# Altium schematic sheet Peripherals.SchDoc: Peripherals
size A3; Author: Silard Gal; SheetNumber: 6; SheetTotal: 7
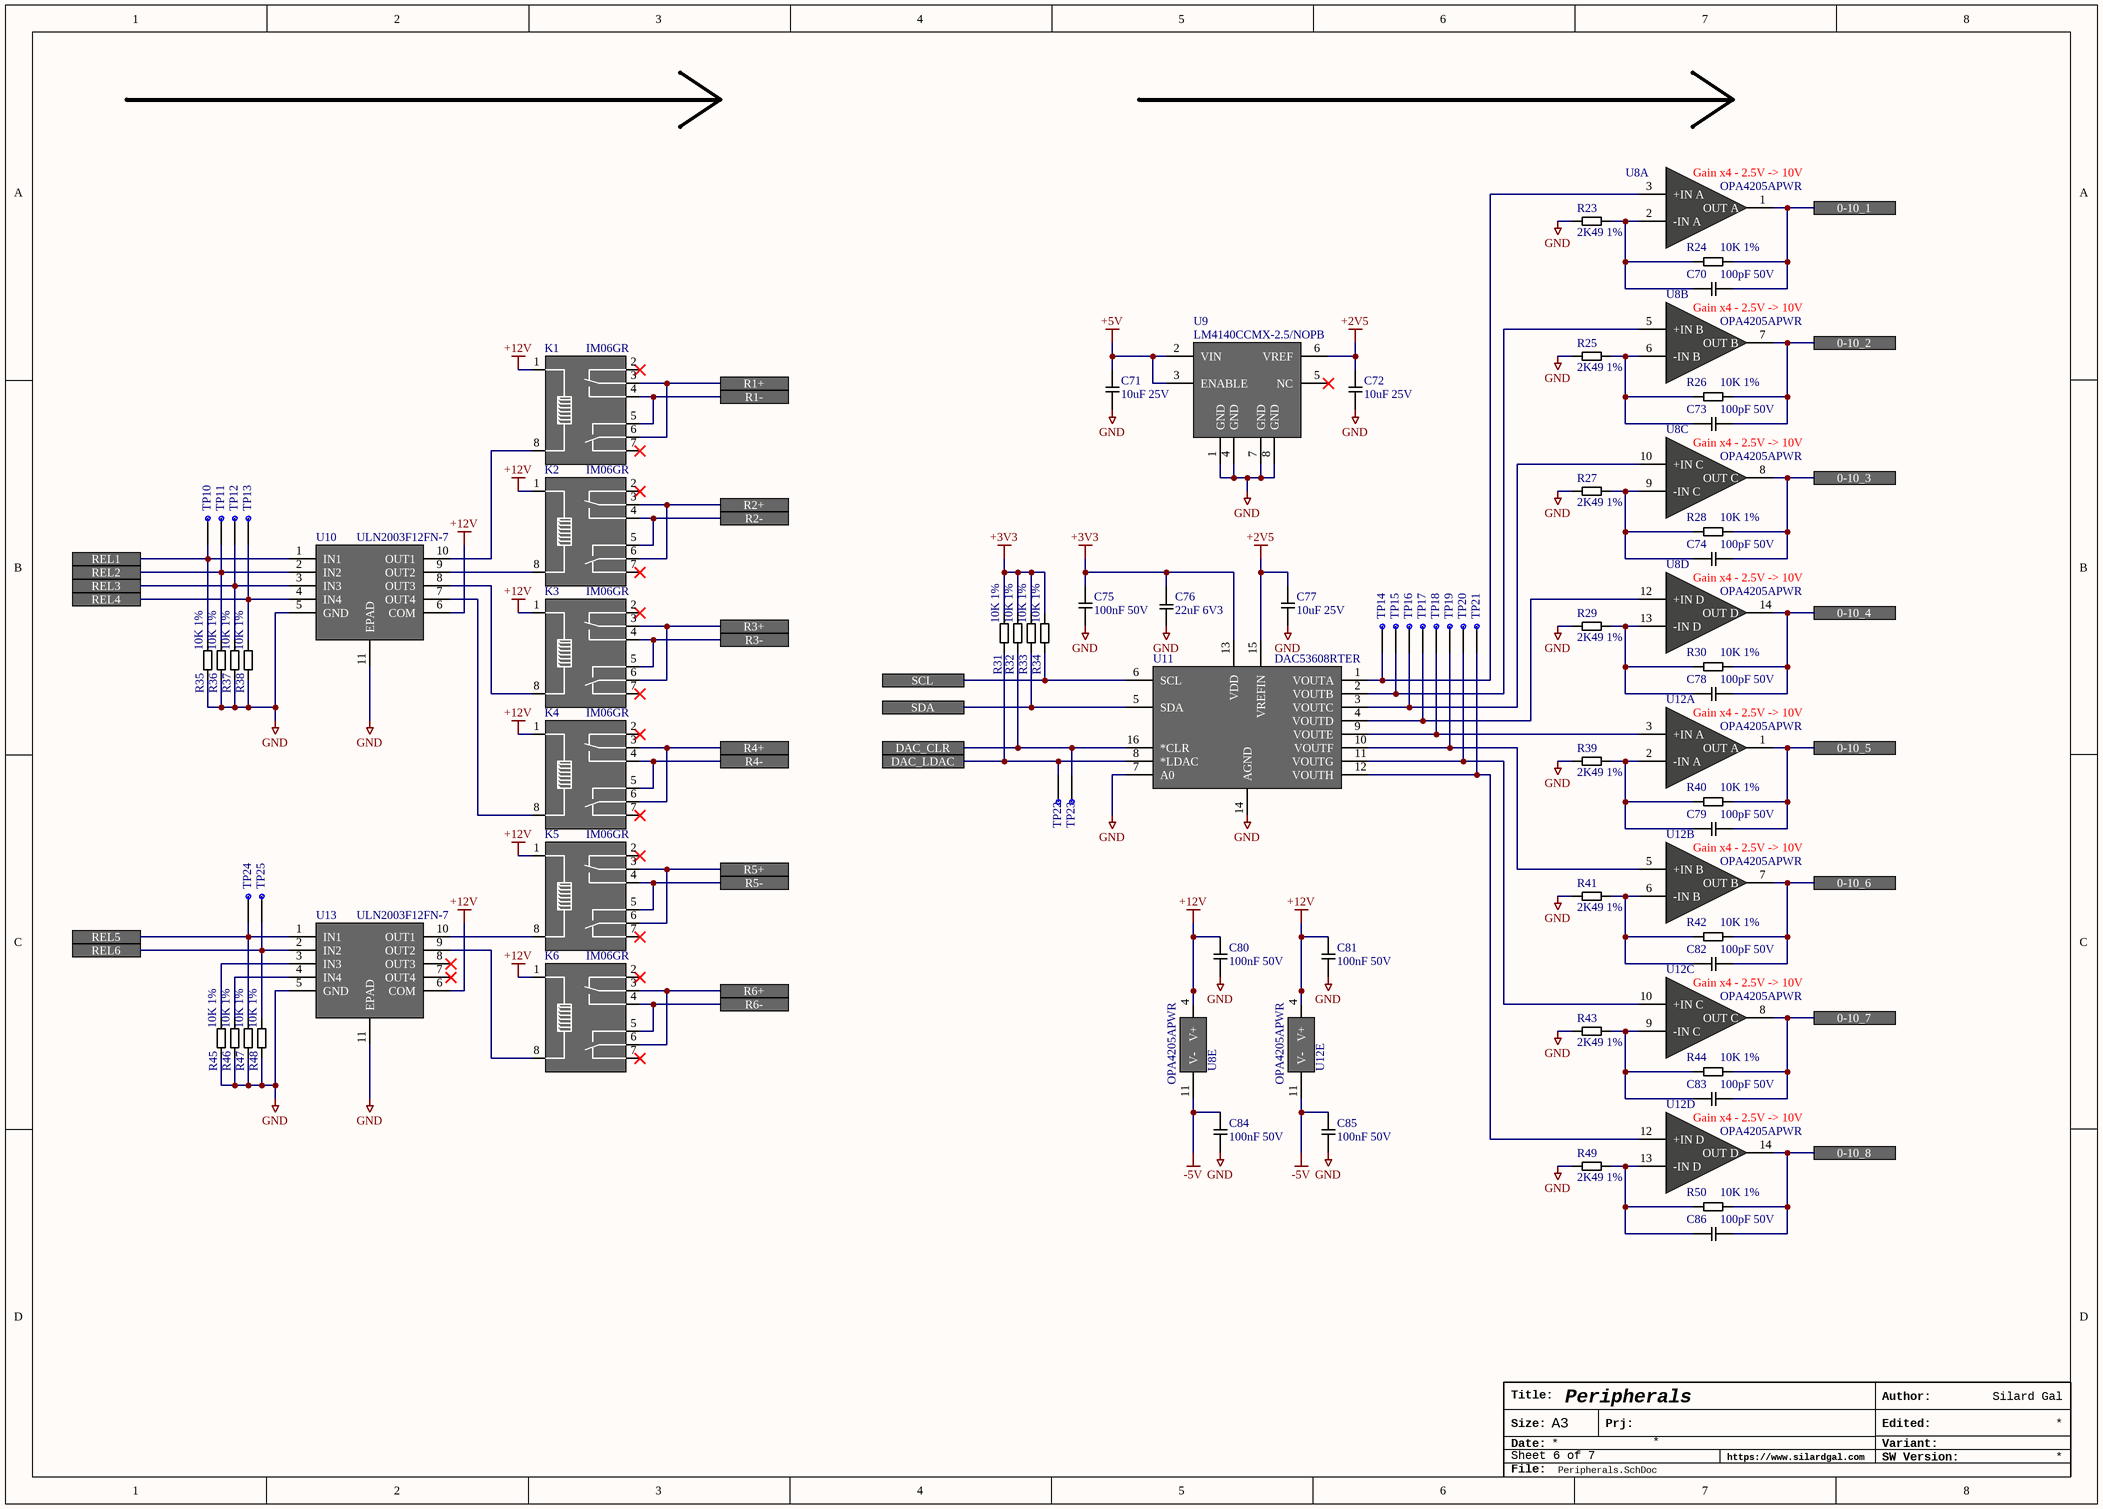
[diagram p0: Peripherals.SchDoc]

## Parts
C70  100pF 50V  [CAPC1608X06N]
C71  10uF 25V  [CAPC1608X06N]
C72  10uF 25V  [CAPC1608X06N]
C73  100pF 50V  [CAPC1608X06N]
C74  100pF 50V  [CAPC1608X06N]
C75  100nF 50V  [CAPC1608X06N]
C76  22uF 6V3  [CAPC1608X06N]
C77  10uF 25V  [CAPC1608X06N]
C78  100pF 50V  [CAPC1608X06N]
C79  100pF 50V  [CAPC1608X06N]
C80  100nF 50V  [CAPC1608X06N]
C81  100nF 50V  [CAPC1608X06N]
C82  100pF 50V  [CAPC1608X06N]
C83  100pF 50V  [CAPC1608X06N]
C84  100nF 50V  [CAPC1608X06N]
C85  100nF 50V  [CAPC1608X06N]
C86  100pF 50V  [CAPC1608X06N]
K1  IM06GR  [IM06GR]
K2  IM06GR  [IM06GR]
K3  IM06GR  [IM06GR]
K4  IM06GR  [IM06GR]
K5  IM06GR  [IM06GR]
K6  IM06GR  [IM06GR]
R23  2K49 1%  [RESC1608X06N]
R24  10K 1%  [RESC1608X06N]
R25  2K49 1%  [RESC1608X06N]
R26  10K 1%  [RESC1608X06N]
R27  2K49 1%  [RESC1608X06N]
R28  10K 1%  [RESC1608X06N]
R29  2K49 1%  [RESC1608X06N]
R30  10K 1%  [RESC1608X06N]
R31  10K 1%  [RESC1608X06N]
R32  10K 1%  [RESC1608X06N]
R33  10K 1%  [RESC1608X06N]
R34  10K 1%  [RESC1608X06N]
R35  10K 1%  [RESC1608X06N]
R36  10K 1%  [RESC1608X06N]
R37  10K 1%  [RESC1608X06N]
R38  10K 1%  [RESC1608X06N]
R39  2K49 1%  [RESC1608X06N]
R40  10K 1%  [RESC1608X06N]
R41  2K49 1%  [RESC1608X06N]
R42  10K 1%  [RESC1608X06N]
R43  2K49 1%  [RESC1608X06N]
R44  10K 1%  [RESC1608X06N]
R45  10K 1%  [RESC1608X06N]
R46  10K 1%  [RESC1608X06N]
R47  10K 1%  [RESC1608X06N]
R48  10K 1%  [RESC1608X06N]
R49  2K49 1%  [RESC1608X06N]
R50  10K 1%  [RESC1608X06N]
TP10  TP  [TP]  (value not drawn)  (no BOM)
TP11  TP  [TP]  (value not drawn)  (no BOM)
TP12  TP  [TP]  (value not drawn)  (no BOM)
TP13  TP  [TP]  (value not drawn)  (no BOM)
TP14  TP  [TP]  (value not drawn)  (no BOM)
TP15  TP  [TP]  (value not drawn)  (no BOM)
TP16  TP  [TP]  (value not drawn)  (no BOM)
TP17  TP  [TP]  (value not drawn)  (no BOM)
TP18  TP  [TP]  (value not drawn)  (no BOM)
TP19  TP  [TP]  (value not drawn)  (no BOM)
TP20  TP  [TP]  (value not drawn)  (no BOM)
TP21  TP  [TP]  (value not drawn)  (no BOM)
TP22  TP  [TP]  (value not drawn)  (no BOM)
TP23  TP  [TP]  (value not drawn)  (no BOM)
TP24  TP  [TP]  (value not drawn)  (no BOM)
TP25  TP  [TP]  (value not drawn)  (no BOM)
U8  OPA4205APWR  [TSSO14P440]  (parts A,B,C,D,E of 5)
U9  LM4140CCMX-2.5/NOPB  [SOIC127P599X175-8N]
U10  ULN2003F12FN-7  [DFN3030]
U11  DAC53608RTER  [QFN16P300X300]
U12  OPA4205APWR  [TSSO14P440]  (parts A,B,C,D,E of 5)
U13  ULN2003F12FN-7  [DFN3030]

## Ports
0-10_1, 0-10_2, 0-10_3, 0-10_4, 0-10_5, 0-10_6, 0-10_7, 0-10_8, DAC_CLR, DAC_LDAC, R1+, R1-, R2+, R2-, R3+, R3-, R4+, R4-, R5+, R5-, R6+, R6-, REL1, REL2, REL3, REL4, REL5, REL6, SCL, SDA

## Nets
+2V5: C72.2 C77.2 U9.6(VREF) U11.15(VREFIN)
+3V3: C75.2 C76.1 R31.1 R32.1 R33.1 R34.1 U11.13(VDD)
+5V: C71.2 U9.2(VIN) U9.3(ENABLE)
+12V: C80.2 C81.2 K1.1 K2.1 K3.1 K4.1 K5.1 K6.1 U8.4(V+) U10.6(COM) U12.4(V+) U13.6(COM)
-5V: C84.2 C85.2 U8.11(V-) U12.11(V-)
GND: C71.1 C72.1 C75.1 C76.2 C77.1 C80.1 C81.1 C84.1 C85.1 R23.1 R25.1 R27.1 R29.1 R35.2 R36.2 R37.2 R38.2 R39.1 R41.1 R43.1 R45.2 R46.2 R47.2 R48.2 R49.1 U9.1(GND) U9.4(GND) U9.7(GND) U9.8(GND) U10.5(GND) U10.11(EPAD) U11.7(A0) U11.14(AGND) U13.5(GND) U13.11(EPAD)
0-10_1: C70.2 R24.2 U8.1(OUT_A) ; port 0-10_1
0-10_2: C73.2 R26.2 U8.7(OUT_B) ; port 0-10_2
0-10_3: C74.2 R28.2 U8.8(OUT_C) ; port 0-10_3
0-10_4: C78.2 R30.2 U8.14(OUT_D) ; port 0-10_4
0-10_5: C79.2 R40.2 U12.1(OUT_A) ; port 0-10_5
0-10_6: C82.2 R42.2 U12.7(OUT_B) ; port 0-10_6
0-10_7: C83.2 R44.2 U12.8(OUT_C) ; port 0-10_7
0-10_8: C86.2 R50.2 U12.14(OUT_D) ; port 0-10_8
DAC_CLR: R32.2 TP23.1 U11.16(*CLR) ; port DAC_CLR
DAC_LDAC: R31.2 TP22.1 U11.8(*LDAC) ; port DAC_LDAC
R1+: K1.3 K1.6 ; port R1+
R1-: K1.4 K1.5 ; port R1-
R2+: K2.3 K2.6 ; port R2+
R2-: K2.4 K2.5 ; port R2-
R3+: K3.3 K3.6 ; port R3+
R3-: K3.4 K3.5 ; port R3-
R4+: K4.3 K4.6 ; port R4+
R4-: K4.4 K4.5 ; port R4-
R5+: K5.3 K5.6 ; port R5+
R5-: K5.4 K5.5 ; port R5-
R6+: K6.3 K6.6 ; port R6+
R6-: K6.4 K6.5 ; port R6-
REL1: R35.1 TP10.1 U10.1(IN1) ; port REL1
REL2: R36.1 TP11.1 U10.2(IN2) ; port REL2
REL3: R37.1 TP12.1 U10.3(IN3) ; port REL3
REL4: R38.1 TP13.1 U10.4(IN4) ; port REL4
REL5: R47.1 TP24.1 U13.1(IN1) ; port REL5
REL6: R48.1 TP25.1 U13.2(IN2) ; port REL6
SCL: R34.2 U11.6(SCL) ; port SCL
SDA: R33.2 U11.5(SDA) ; port SDA
NetC70_1: C70.1 R23.2 R24.1 U8.2(-IN_A)
NetC73_1: C73.1 R25.2 R26.1 U8.6(-IN_B)
NetC74_1: C74.1 R27.2 R28.1 U8.9(-IN_C)
NetC78_1: C78.1 R29.2 R30.1 U8.13(-IN_D)
NetC79_1: C79.1 R39.2 R40.1 U12.2(-IN_A)
NetC82_1: C82.1 R41.2 R42.1 U12.6(-IN_B)
NetC83_1: C83.1 R43.2 R44.1 U12.9(-IN_C)
NetC86_1: C86.1 R49.2 R50.1 U12.13(-IN_D)
NetK1_8: K1.8 U10.10(OUT1)
NetK2_8: K2.8 U10.9(OUT2)
NetK3_8: K3.8 U10.8(OUT3)
NetK4_8: K4.8 U10.7(OUT4)
NetK5_8: K5.8 U13.10(OUT1)
NetK6_8: K6.8 U13.9(OUT2)
NetR45_1: R45.1 U13.3(IN3)
NetR46_1: R46.1 U13.4(IN4)
NetTP14_1: TP14.1 U8.3(+IN_A) U11.1(VOUTA)
NetTP15_1: TP15.1 U8.5(+IN_B) U11.2(VOUTB)
NetTP16_1: TP16.1 U8.10(+IN_C) U11.3(VOUTC)
NetTP17_1: TP17.1 U8.12(+IN_D) U11.4(VOUTD)
NetTP18_1: TP18.1 U11.9(VOUTE) U12.3(+IN_A)
NetTP19_1: TP19.1 U11.10(VOUTF) U12.5(+IN_B)
NetTP20_1: TP20.1 U11.11(VOUTG) U12.10(+IN_C)
NetTP21_1: TP21.1 U11.12(VOUTH) U12.12(+IN_D)

Not connected (* = marked no-connect by the designer): K1 2* 7*; K2 2* 7*; K3 2* 7*; K4 2* 7*; K5 2* 7*; K6 2* 7*; U9 5(NC)*; U13 7(OUT4)* 8(OUT3)*

## Notes on the sheet
- (near U8) Gain x4 - 2.5V -> 10V
- Gain x4 - 2.5V -> 10V
- Title:
- Author:
- Size:
- Date:
- A3
- Prj:
- https://www.silardgal.com
- SW Version:
- Variant:
- Edited:
- File:

## Library data of the parts
C70 C73 C74 C78 C79 C82 C83 C86 = 100pF 50V: 100 pF ±10% 50V Ceramic Capacitor C0G, NP0 0603 (1608 Metric); MPN: KGM15ACG1H101KT
C71 C72 C77 = 10uF 25V: 10 µF ±20% 25V Ceramic Capacitor X5R 0603 (1608 Metric); MPN: GRM188R61E106MA73D
C75 C80 C81 C84 C85 = 100nF 50V: 0.1 µF ±10% 50V Ceramic Capacitor X7R 0603 (1608 Metric); MPN: GCM188R71H104KA57D
C76 = 22uF 6V3: 22 µF ±20% 6.3V Ceramic Capacitor X5R 0603 (1608 Metric); MPN: GRM188R60J226MEA0D
K1-K6 = IM06GR: Telecom Relay DPDT (2 Form C) Surface Mount; MPN: IM06GR
R23 R25 R27 R29 R39 R41 R43 R49 = 2K49 1%: 2.49 kOhms ±1% 0.1W, 1/10W Chip Resistor 0603 (1608 Metric) Automotive AEC-Q200 Thick Film; MPN: RMCF0603FT2K49
R24 R26 R28 R30-R38 R40 R42 R44-R48 R50 = 10K 1%: 10 kOhms ±1% 0.1W, 1/10W Chip Resistor 0603 (1608 Metric) Automotive AEC-Q200 Thick Film; MPN: ERJ-3EKF1002V
U8 U12 = OPA4205APWR: General Purpose Amplifier 4 Circuit Push-Pull, Rail-to-Rail 14-TSSOP; MPN: OPA4205APWR
U9 = LM4140CCMX-2.5/NOPB: Series Voltage Reference IC Fixed 2.5V V ±0.1% 8 mA 8-SOIC; MPN: LM4140CCMX-2.5/NOPB
U10 U13 = ULN2003F12FN-7: Power Switch/Driver 1:1 Darlington 700mA U-DFN3030-10; MPN: ULN2003F12FN-7
U11 = DAC53608RTER: 10 Bit Digital to Analog Converter 8 16-WQFN (3x3); MPN: DAC53608RTER